# EAGLE design smartbedlight2.5 (EAGLE 6.5.0)
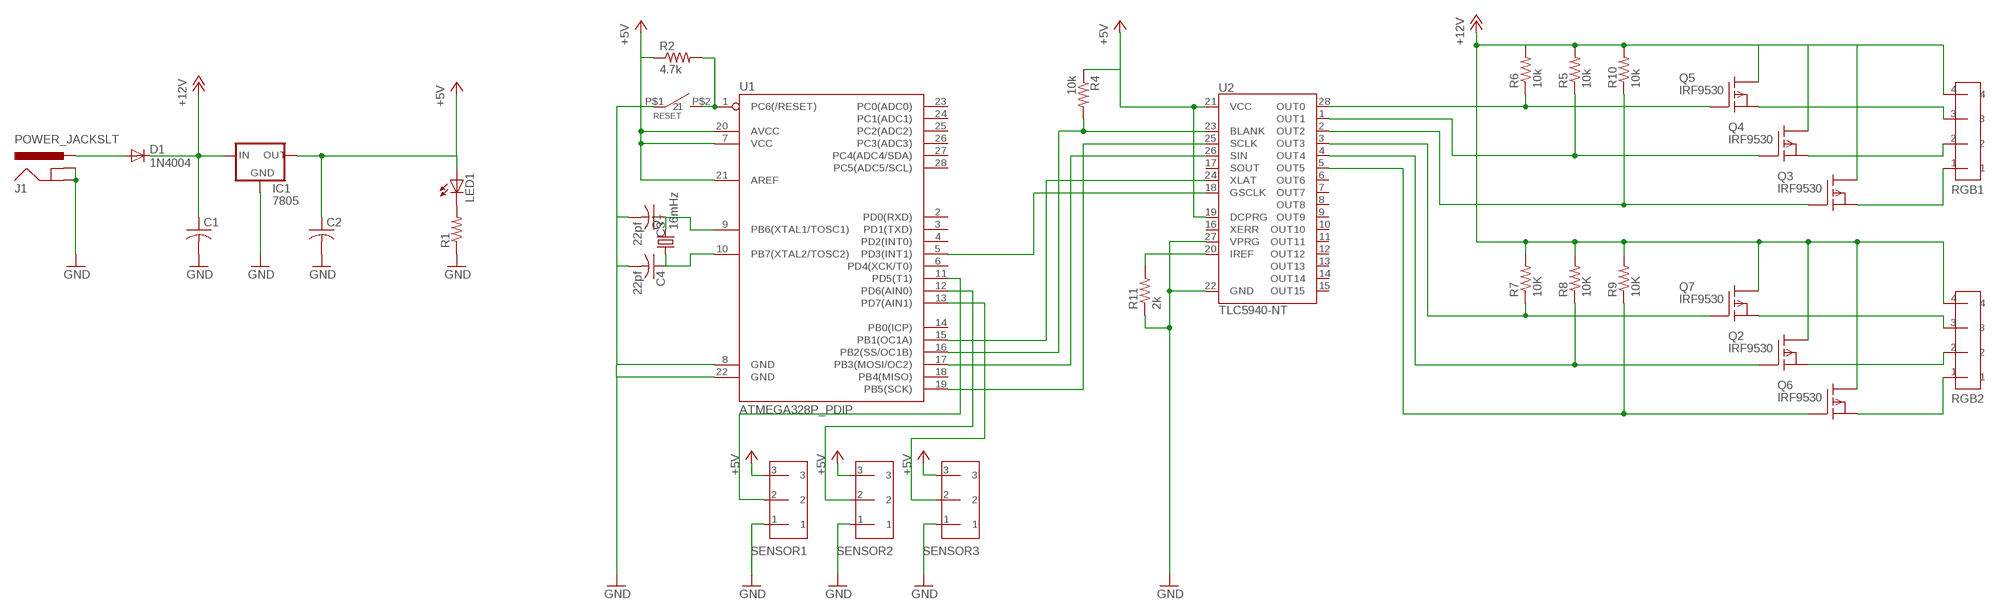
[diagram p0: schematic, sheet 1]

## Parts
C1  C-US025-030X050  [C025-030X050]
C2  C-US025-030X050  [C025-030X050]
C3  22pf  C-US025-025X050  [C025-025X050]
C4  22pf  C-US025-025X050  [C025-025X050]
D1  1N4004  [DO41-10]
IC1  7805  V_REG_78XXSIDE  [78XXL]
J1  POWER_JACKSLT  [POWER_JACK_SLOT]
LED1  LED5MM  [LED5MM]
Q1  16mHz  CRYSTALHC49U-V  [HC49U-V]
Q2  IRF9530  [TO220]
Q3  IRF9530  [TO220]
Q4  IRF9530  [TO220]
Q5  IRF9530  [TO220]
Q6  IRF9530  [TO220]
Q7  IRF9530  [TO220]
R1  R-US_0204/7  [0204/7]
R2  4.7k  R-US_0207/10  [0207/10]
R4  10k  R-US_0207/10  [0207/10]
R5  10k  R-US_M0805  [M0805]
R6  10k  R-US_M0805  [M0805]
R7  10K  R-US_M0805  [M0805]
R8  10K  R-US_M0805  [M0805]
R9  10K  R-US_M0805  [M0805]
R10  10k  R-US_M0805  [M0805]
R11  2k  R-US_0207/10  [0207/10]
RESET  TACK_SWITCH  [TACK_SWITCH]
RGB1  PINHEAD4  [PINHEAD4]
RGB2  PINHEAD4  [PINHEAD4]
SENSOR1  PINHEAD3  [PINHEAD]
SENSOR2  PINHEAD3  [PINHEAD]
SENSOR3  PINHEAD3  [PINHEAD]
U1  ATMEGA328P_PDIP  [DIL28-3]
U2  TLC5940-NT  [DIL28-3]

## Nets
+5V: C2.1 IC1.OUT LED1.A R2.1 R4.1 SENSOR1.3 SENSOR2.3 SENSOR3.3 U1.7(VCC) U1.20(AVCC) U1.21(AREF) U2.19(DCPRG) U2.21(VCC)
+12V: C1.1 D1.C IC1.IN Q2.2(D) Q3.2(D) Q4.2(D) Q5.2(D) Q6.2(D) Q7.2(D) R5.2 R6.2 R7.2 R8.2 R9.2 R10.2 RGB1.4 RGB2.4
GND: C1.2 C2.2 C3.2 C4.2 IC1.GND J1.GND@1(GNDBREAK) J1.GND@2(GND) R1.1 R11.1 RESET.P$1 SENSOR1.1 SENSOR2.1 SENSOR3.1 U1.8(GND) U1.22(GND) U2.22(GND) U2.27(VPRG)
N$1: LED1.K(C) R1.2
N$2: D1.A J1.PWR
N$3: R2.2 RESET.P$2 U1.1(PC6(/RESET))
N$4: R4.2 U1.16(PB2(SS/OC1B)) U2.23(BLANK)
N$5: C4.1 Q1.1 U1.10(PB7(XTAL2/TOSC2))
N$7: SENSOR2.2 U1.12(PD6(AIN0))
N$8: U1.5(PD3(INT1)) U2.18(GSCLK)
N$9: SENSOR1.2 U1.11(PD5(T1))
N$10: SENSOR3.2 U1.13(PD7(AIN1))
N$11: Q3.1(G) R10.1 U2.2(OUT2)
N$12: U1.17(PB3(MOSI/OC2)) U2.26(SIN)
N$13: Q7.1(G) R7.1 U2.3(OUT3)
N$14: Q6.1(G) R9.1 U2.5(OUT5)
N$15: Q2.1(G) R8.1 U2.4(OUT4)
N$16: Q5.1(G) R6.1 U2.28(OUT0)
N$17: Q4.1(G) R5.1 U2.1(OUT1)
N$18: U1.19(PB5(SCK)) U2.25(SCLK)
N$19: U1.15(PB1(OC1A)) U2.24(XLAT)
N$21: Q6.3(S) RGB2.1
N$22: Q2.3(S) RGB2.2
N$23: Q7.3(S) RGB2.3
N$24: Q5.3(S) RGB1.3
N$25: Q4.3(S) RGB1.2
N$26: Q3.3(S) RGB1.1
N$27: R11.2 U2.20(IREF)
N$28: C3.1 Q1.2 U1.9(PB6(XTAL1/TOSC1))
Unconnected: U1.2(PD0(RXD)) U1.3(PD1(TXD)) U1.4(PD2(INT0)) U1.6(PD4(XCK/T0)) U1.14(PB0(ICP)) U1.18(PB4(MISO)) U1.23(PC0(ADC0)) U1.24(PC1(ADC1)) U1.25(PC2(ADC2)) U1.26(PC3(ADC3)) U1.27(PC4(ADC4/SDA)) U1.28(PC5(ADC5/SCL)) U2.6(OUT6) U2.7(OUT7) U2.8(OUT8) U2.9(OUT9) U2.10(OUT10) U2.11(OUT11) U2.12(OUT12) U2.13(OUT13) U2.14(OUT14) U2.15(OUT15) U2.16(XERR) U2.17(SOUT)

## Library data of the parts
C1 C2 = rcl:C-US: CAPACITOR, American symbol
C3 C4 = resistor:C-US: CAPACITOR, American symbol
D1 = diode:1N4004: DIODE general purpose rectifier, 1 A
IC1 = SparkFun-PowerIC:V_REG_78XX: Voltage Regulator Standard 7805 5V regulator. IGO (Input Ground Output). Spark Fun Electronics SKU : COM-00107
J1 = SparkFun:POWER_JACK: Power Jack This is the standard 5.5mm barrel jack for power. The PTH is the most common, proven, reliable, footprint. All others are experimental. The Slot footprint only works if the mill layer is transmitted to the PCB fab house so be warned. Spark Fun Electronics SKU : PRT-00119. Mating wall wart : TOL-00298 (and others)
LED1 = led:LED: LED OSRAM: - CHIPLED LG R971, LG N971, LY N971, LG Q971, LY Q971, LO R971, LY R971 LH N974, LH R974 LS Q976, LO Q976, LY Q976 LO Q996 - Hyper CHIPLED LW Q18S LB Q993, LB Q99A, LB R99A - SideLED LS A670, LO A670, LY A670, LG A670, LP A670 LB A673, LV A673, LT A673, LW A673 LH A674 LY A675 LS A676, LA A676, LO A676, LY A676, LW A676 LS A679, LY A679, LG A679 - Hyper Micro SIDELED® LS Y876, LA Y876, LO Y876, LY Y876 LT Y87S - SmartLED LW L88C, LW L88S LB L89C, LB L89S, LG L890 LS L89K, LO L89K, LY L89K LS L896, LA L896, LO L896, LY L896 - TOPLED LS T670, LO T670, LY T670, LG T670, LP T670 LSG T670, LSP T670, LSY T670, LOP T670, LYG T670 LG T671, LOG T671, LSG T671 LB T673, LV T673, LT T673, LW T673 LH T674 LS T676, LA T676, LO T676, LY T676, LB T676, LH T676, LSB T676, LW T676 LB T67C, LV T67C, LT T67C, LS T67K, LO T67K, LY T67K, LW E67C LS E67B, LA E67B, LO E67B, LY E67B, LB E67C, LV E67C, LT E67C LW T67C LS T679, LY T679, LG T679 LS T770, LO T770, LY T770, LG T770, LP T770 LB T773, LV T773, LT T773, LW T773 LH T774 LS E675, LA E675, LY E675, LS T675 LS T776, LA T776, LO T776, LY T776, LB T776 LHGB T686 LT T68C, LB T68C - Hyper Mini TOPLED® LB M676 - Mini TOPLED Santana® LG M470 LS M47K, LO M47K, LY M47K Source: http://www.osram.convergy.de LUXEON: - LUMILED® LXK2-PW12-R00, LXK2-PW12-S00, LXK2-PW14-U00, LXK2-PW14-V00 LXK2-PM12-R00, LXK2-PM12-S00, LXK2-PM14-U00 LXK2-PE12-Q00, LXK2-PE12-R00, LXK2-PE12-S00, LXK2-PE14-T00, LXK2-PE14-U00 LXK2-PB12-K00, LXK2-PB12-L00, LXK2-PB12-M00, LXK2-PB14-N00, LXK2-PB14-P00, LXK2-PB14-Q00 LXK2-PR12-L00, LXK2-PR12-M00, LXK2-PR14-Q00, LXK2-PR14-R00 LXK2-PD12-Q00, LXK2-PD12-R00, LXK2-PD12-S00 LXK2-PH12-R00, LXK2-PH12-S00 LXK2-PL12-P00, LXK2-PL12-Q00, LXK2-PL12-R00 Source: www.luxeon.com KINGBRIGHT: KA-3528ASYC Source: www.kingbright.com
Q1 = crystal:CRYSTAL: CRYSTAL; OC_FARNELL: 1666969; OC_NEWARK: unknown
Q2-Q7 = transistor-fet:IRF9530: P-Channel Enhancement MOSFET (HEXFET); -100V; -12A; 0,3Ohm
R1 = rcl:R-US_: RESISTOR, American symbol
R2 R4-R11 = resistor:R-US_: RESISTOR, American symbol
RESET = compass:TACK_SWITCH
RGB1 RGB2 = pinhead3.96:PINHEAD4
SENSOR1-SENSOR3 = pinhead3.96:PINHEAD3
U1 = SparkFun-DigitalIC:ATMEGA328P_PDIP: uC used in the Arduino 32kb flash, 1k EEPROM, 2k SRAM This is the through-hole version of this chip.
U2 = SparkFun-DigitalIC:TLC5940: 16-channel LED Driver with Dot Correction and Grayscale PWM Control The TLC5940 is a 16-channel, constant-current sink LED driver. Each channel has an individually adjustable 4096-step grayscale PWM brightness control and a 64-step, constant-current sink (dot correction). The dot correction adjusts the brightness variations between LED channels and other LED drivers. The dot correction data is stored in an integrated EEPROM. Both grayscale control and dot correction are accessible via a serial interface. A single external resistor sets the maximum current value of all 16 channels. Packages: 28-pin HTSSOP 32-pin 5x5mm QFN 28-pin DIP

## Board
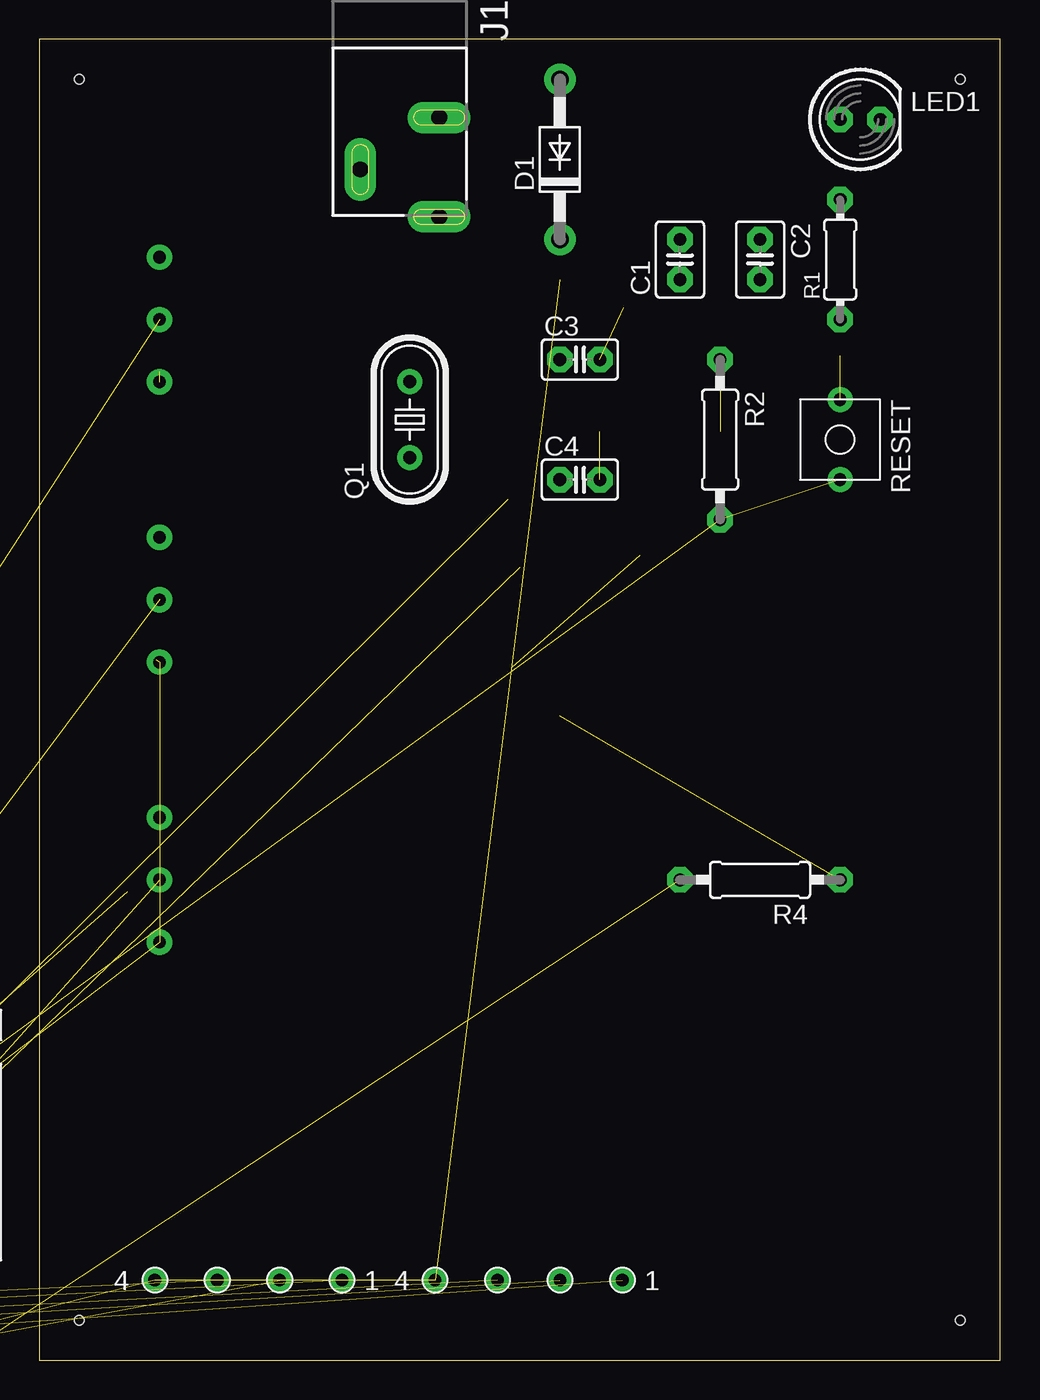
[diagram p1: board, top side]
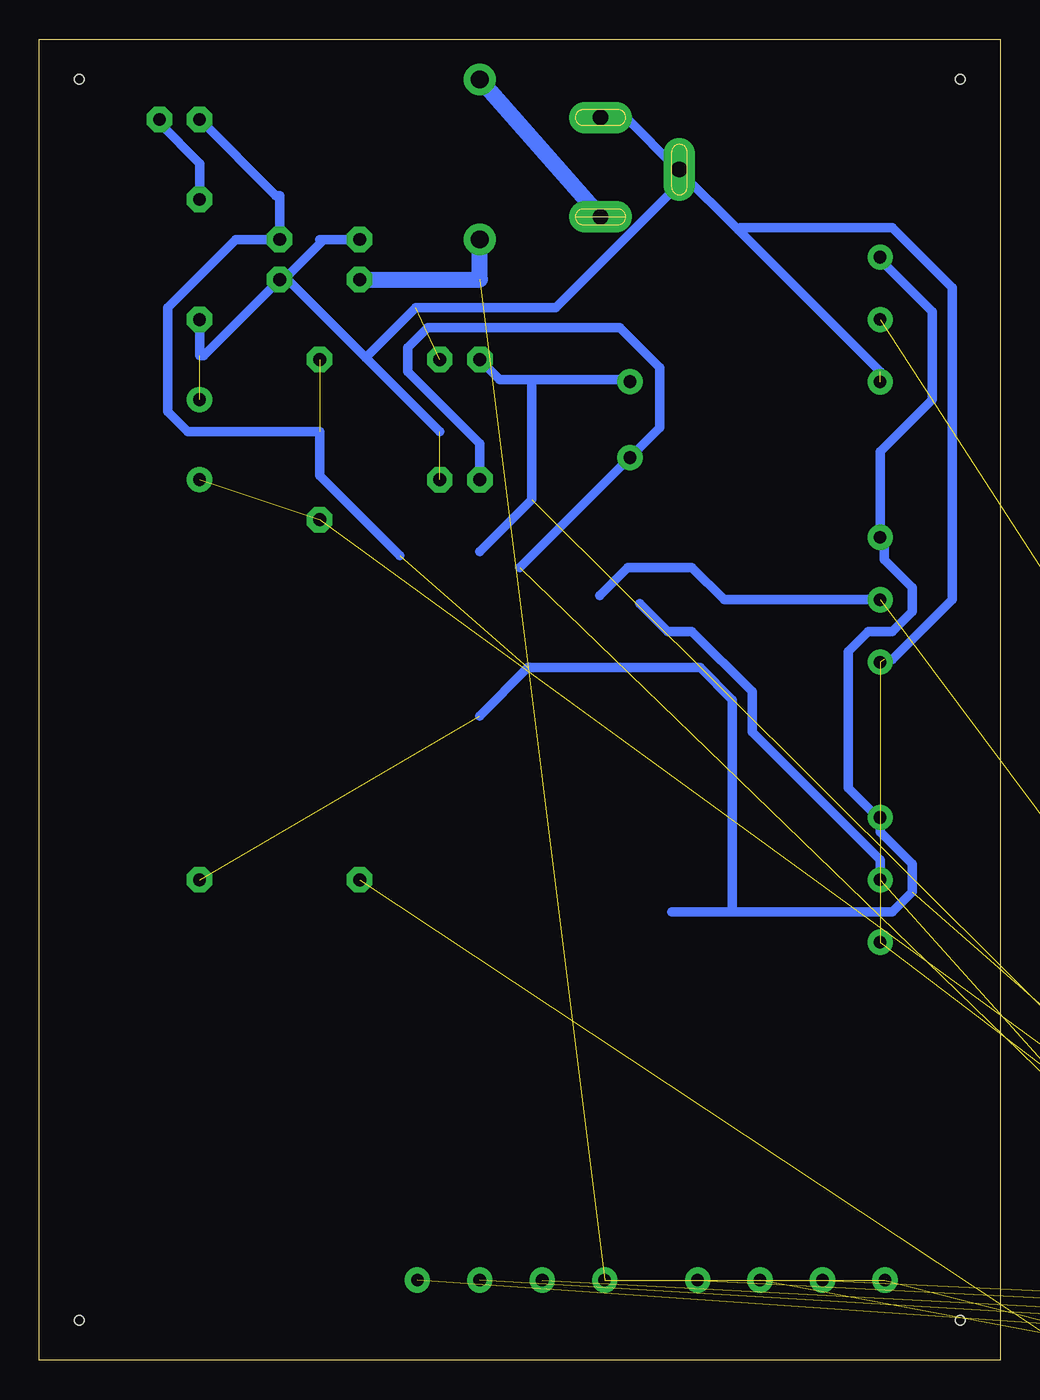
[diagram p2: board, bottom side, seen from below]

Size 60.96 x 83.82 mm. Coordinates in mm from the lower left corner, seen from the top.
Outline: 0,0 60.96,0 60.96,83.82 0,83.82 0,0
Copper layers (1*16): Top 0.035mm / dielectric 1.5mm / Bottom 0.035mm
Design rules "default": minimum track width 0.6mm, minimum drill 0.8mm, track to track 0.6mm, track to pad 0.7mm, pad to pad 0.3mm, via to via 0.8mm, smd to smd 8mil, copper to edge 10mil, drill to drill 8mil, minimum pad ring 0.4mm, minimum via ring 0.6mm, stop-mask expansion 0mil, vias tented up to drill 0mil, thermal gap 10mil
Holes 0.6 mm at 2.54,81.28 2.54,2.54 58.42,2.54 58.42,81.28

### Footprints (pad centres in the part's own frame; a part is rotated, then mirrored left to right if it is on the bottom)
C025-030X050 = drill 0.813 octagon: 1 -1.27,0; 2 1.27,0
C025-025X050 = drill 0.813 octagon: 1 -1.27,0; 2 1.27,0
DO41-10 = drill 1.118: A 5.08,0; C -5.08,0
78XXL = drill 1.016 long: GND 0,-3.81; IN -2.54,-3.81; OUT 2.54,-3.81 | hole 3.302: 0,11.176
POWER_JACK_SLOT = drill 1 pad 2 long: GND@1 2.58,7.5; GND@2 7.58,10.8; PWR 2.58,13.8
LED5MM = drill 0.813 octagon: A -1.27,0; K 1.27,0
HC49U-V = drill 0.813: 1 -2.413,0; 2 2.413,0
TO220 = drill 1.118 long: 1 -2.54,-6.35; 2 0,-6.35; 3 2.54,-6.35 | hole 3.302: 0,11.176
0204/7 = drill 0.813 octagon: 1 -3.81,0; 2 3.81,0
0207/10 = drill 0.813 octagon: 1 -5.08,0; 2 5.08,0
M0805 = smd 1.3 x 1.6: 1 -0.95,0; 2 0.95,0
TACK_SWITCH = drill 0.8: P$1 -2.54,0; P$2 2.54,0
PINHEAD4 = drill 0.8: 1 -3.96,0; 2 0,0; 3 3.96,0; 4 7.92,0
PINHEAD = drill 0.8: 1 -3.96,0; 2 0,0; 3 3.96,0
DIL28-3 = drill 0.813 long: 1 -16.51,-3.81; 2 -13.97,-3.81; 3 -11.43,-3.81; 4 -8.89,-3.81; 5 -6.35,-3.81; 6 -3.81,-3.81; 7 -1.27,-3.81; 8 1.27,-3.81; 9 3.81,-3.81; 10 6.35,-3.81; 11 8.89,-3.81; 12 11.43,-3.81; 13 13.97,-3.81; 14 16.51,-3.81; 15 16.51,3.81; 16 13.97,3.81; 17 11.43,3.81; 18 8.89,3.81; 19 6.35,3.81; 20 3.81,3.81; 21 1.27,3.81; 22 -1.27,3.81; 23 -3.81,3.81; 24 -6.35,3.81; 25 -8.89,3.81; 26 -11.43,3.81; 27 -13.97,3.81; 28 -16.51,3.81

### Placement (x,y rotation side)
C1  40.64,69.85 90 top
C2  45.72,69.85 270 top
C3  34.29,63.5 0 top
C4  34.29,55.88 0 top
D1  33.02,76.2 90 top
IC1  -83.82,-25.4 0 top  (outside the outline)
J1  27.94,86.36 180 top
LED1  52.07,78.74 0 top
Q1  23.5,59.69 90 top
Q2  -7.62,7.62 0 top  (outside the outline)
Q3  -20.32,7.62 0 top  (outside the outline)
Q4  -33.02,7.62 0 top  (outside the outline)
Q5  -45.72,7.62 0 top  (outside the outline)
Q6  -58.42,7.62 0 top  (outside the outline)
Q7  -71.12,7.62 0 top  (outside the outline)
R1  50.8,69.85 90 top
R2  43.18,58.42 270 top
R4  45.72,30.48 180 top
R5  -73.66,-5.08 0 top  (outside the outline)
R6  -73.66,-10.16 0 top  (outside the outline)
R7  -73.66,-15.24 0 top  (outside the outline)
R8  -73.66,-20.32 0 top  (outside the outline)
R9  -73.66,-25.4 0 top  (outside the outline)
R10  -73.66,-30.48 0 top  (outside the outline)
R11  -81.28,-58.42 0 top  (outside the outline)
RESET  50.8,58.42 270 top
RGB1  33.02,5.08 180 top
RGB2  15.24,5.08 180 top
SENSOR1  7.62,66.04 90 top
SENSOR2  7.62,48.26 90 top
SENSOR3  7.62,30.48 90 top
U1  -71.12,-38.1 0 top  (outside the outline)
U2  -71.12,-48.26 0 top  (outside the outline)

### Tracks (layer width: path | path; a pad name or v marks a point on that pad's centre or on a via)
+5V  (9 unrouted)
  Bottom 0.6: SENSOR1.3 7.62,69.85 4.32,66.55 4.32,60.96 7.62,57.66 SENSOR2.3 7.37,52.07 7.37,50.8 5.59,49.02 5.59,47.5 6.86,46.23 8.38,46.23 9.65,44.96 9.65,36.32 7.87,34.54 SENSOR3.3 7.62,33.53 5.59,31.5 5.59,29.72 6.86,28.45 17.02,28.45 | 20.83,28.45 17.02,28.45 | LED1.A 45.97,73.91 45.72,73.91 C2.1 48.51,71.12 52.83,66.8 52.83,60.2 51.56,58.93 43.18,58.93 43.18,56.13 38.1,51.05 | 17.02,28.45 17.02,41.91 19.05,43.94 29.97,43.94 33.02,40.89
+12V  (15 unrouted)
  Bottom 1.016: C1.1 33.02,68.58 D1.C
GND  (12 unrouted)
  Bottom 0.6: 16.64,71.75 20.32,75.44 J1.GND@2 | 16.64,71.75 7.62,62.74 | J1.GND@1 25.15,78.74 23.62,78.74 20.57,75.69 J1.GND@2 | R1.1 50.8,63.75 50.55,63.75 C2.2 | 42.93,71.12 C1.2 | 42.93,71.12 45.47,68.58 C2.2 | 43.18,71.12 42.93,71.12 | 40.26,63.63 45.21,68.58 C2.2 | 40.26,63.63 35.56,58.93 | 40.26,63.63 37.08,66.8 28.19,66.8 20.07,74.93 J1.GND@2 | 7.37,44.45 6.86,44.45 3.05,48.26 3.05,68.07 6.86,71.88 16.51,71.88 16.64,71.75
N$1
  Bottom 0.6: R1.2 50.8,75.95 53.34,78.49 LED1.K
N$2
  Bottom 1.016: J1.PWR D1.A
N$3  (2 unrouted)
N$4  (2 unrouted)
N$5  (1 unrouted)
  Bottom 0.6: 30.48,50.29 Q1.1 21.59,59.18 21.59,62.99 24.13,65.53 36.32,65.53 37.59,64.26 37.59,62.74 33.02,58.17 C4.1
N$7  (1 unrouted)
  Bottom 0.6: SENSOR2.2 17.53,48.26 19.56,50.29 23.62,50.29 25.4,48.51
N$8  (1 unrouted)
N$9  (1 unrouted)
N$10  (1 unrouted)
  Bottom 0.6: SENSOR3.2 7.62,31.75 15.75,39.88 15.75,42.42 19.56,46.23 21.08,46.23 22.86,48.01
N$11  (2 unrouted)
N$12  (1 unrouted)
N$13  (2 unrouted)
N$14  (2 unrouted)
N$15  (2 unrouted)
N$16  (2 unrouted)
N$17  (2 unrouted)
N$18  (1 unrouted)
N$19  (1 unrouted)
N$21  (1 unrouted)
N$22  (1 unrouted)
N$23  (1 unrouted)
N$24  (1 unrouted)
N$25  (1 unrouted)
N$26  (1 unrouted)
N$27  (1 unrouted)
N$28  (1 unrouted)
  Bottom 0.6: 29.72,62.23 31.75,62.23 C3.1 | 29.72,62.23 23.62,62.23 Q1.2 | 33.02,51.31 29.72,54.61 29.72,62.23